# EAGLE design interstage_B2v2 (EAGLE 9.6.1)
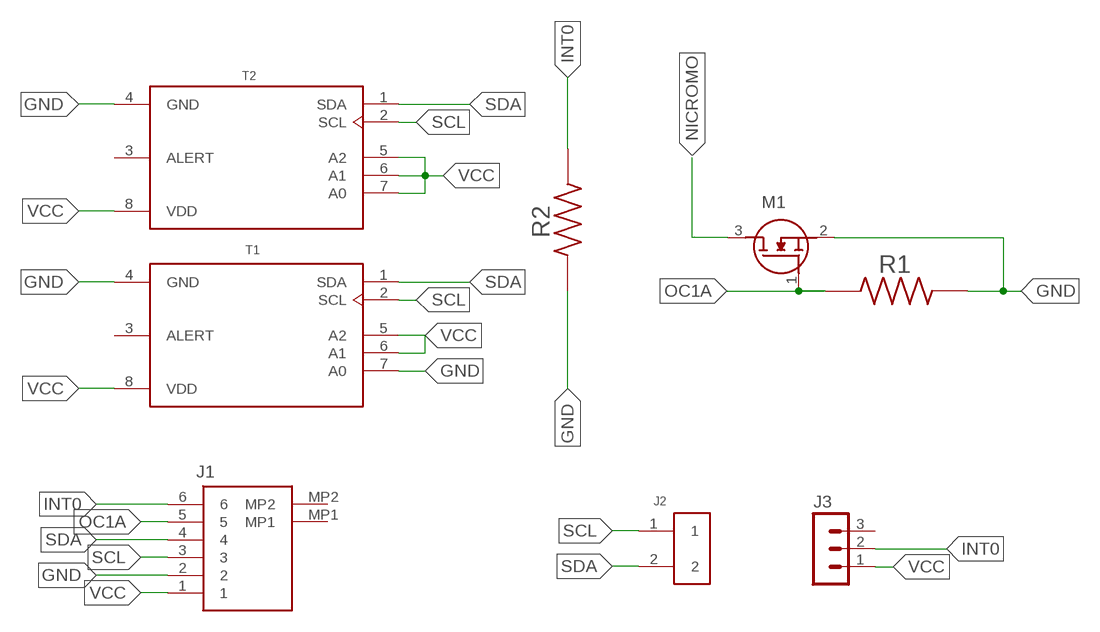
[diagram p0: schematic, sheet 1]

## Parts
J1  53261-7006  [532617006]
J2  0532610271  [MOLEX_0532610271]
J3  MA03-1  [MA03-1]
M1  PMV16XNR  [SOT95P230X110-3N]
R1  330  ERA-8AEB331V  [RESC3216X70N]
R2  330  ERA-8AEB331V  [RESC3216X70N]
T1  MCP9808T-E/MS  [SOP65P490X110-8N]
T2  MCP9808T-E/MS  [SOP65P490X110-8N]

## Nets
GND: J1.2 M1.2(S) R1.2 R2.1 T1.4(GND) T1.7(A0) T2.4(GND)
INT0: J1.6 J3.2 R2.2
NICROMO: M1.3(D)
OC1A: J1.5 M1.1(G) R1.1
SCL: J1.3 J2.1 T1.2(SCL) T2.2(SCL)
SDA: J1.4 J2.2 T1.1(SDA) T2.1(SDA)
VCC: J1.1 J3.1 T1.5(A2) T1.6(A1) T1.8(VDD) T2.5(A2) T2.6(A1) T2.7(A0) T2.8(VDD)
Unconnected: J1.MP1 J1.MP2 J3.3 T1.3(ALERT) T2.3(ALERT)

## Library data of the parts
J1 = SamacSys_Parts:53261-7006: 1.25mm Pitch, PicoBlade PCB Header, Single Row, Right-Angle, Surface Mount, Gold (Au) Plating, Friction Lock, Circuits, Tape and Reel Source: Datasheet <https://componentsearchengine.com/Datasheets/1/53261-7006.pdf>; DESCRIPTION: 1.25mm Pitch, PicoBlade PCB Header, Single Row, Right-Angle, Surface Mount, Gold (Au) Plating, Friction Lock, Circuits, Tape and Reel; HEIGHT: 3.6mm; MANUFACTURER_NAME: Molex; MANUFACTURER_PART_NUMBER: 53261-7006; MOUSER_PART_NUMBER: 538-53261-7006; MOUSER_PRICE-STOCK: https://www.mouser.co.uk/ProductDetail/Molex/53261-7006?qs=0lSvoLzn4L%2FSBef0BTU2GA%3D%3D
J2 = picoblade2:0532610271: 1.25mm (.049") Pitch PicoBlade Header, Surface Mount, Right Angle, Lead-free, 2 Circuits; AVAILABILITY: Unavailable; DESCRIPTION: Picoblade Connector, 2 Circuit Single Row, Right Angle Surface Mount SMT PCB; DIGIKEY-PURCHASE-URL: https://snapeda.com/shop?store=DigiKey&id=4477935; MF: Molex; MP: 0532610271; PACKAGE: None; PRICE: None
J3 = con-lstb:MA03-1: PIN HEADER; OC_FARNELL: unknown; OC_NEWARK: unknown
M1 = SamacSys_Parts:PMV16XNR: Nexperia PMV16XNR N-channel MOSFET, 8.6 A, 20 V PMV16XN, 3-Pin SOT-23 Source: Datasheet <https://componentsearchengine.com/Datasheets/1/PMV16XNR.pdf>; DESCRIPTION: Nexperia PMV16XNR N-channel MOSFET, 8.6 A, 20 V PMV16XN, 3-Pin SOT-23; HEIGHT: 1.1mm; MANUFACTURER_NAME: Nexperia; MANUFACTURER_PART_NUMBER: PMV16XNR; MOUSER_PART_NUMBER: 771-PMV16XNR; MOUSER_PRICE-STOCK: https://www.mouser.com/Search/Refine.aspx?Keyword=771-PMV16XNR
R1 R2 = resistor_330_smd:ERA-8AEB331V; DESCRIPTION: 330 Ohms ±0.1% 0.25W, 1/4W Chip Resistor 1206 (3216 Metric) Automotive AEC-Q200 Thin Film; DIGI-KEY_PART_NUMBER: P330BCCT-ND; MF: Panasonic Electronic; MP: ERA-8AEB331V; PACKAGE: 3216 Panasonic Electronic Components
T1 T2 = sensorSPEL:MCP9808T-E/MS: Board Mount Temperature Sensors Silicon temp sensor with I2C interface; DESCRIPTION: Temperature Sensor Digital, Local -40°C ~ 125°C 10 b 8-MSOP; DIGI-KEY_PART_NUMBER: MCP9808T-E/MSCT-ND; MF: Microchip; MP: MCP9808T-E/MS; PACKAGE: MSOP-8 Microchip

## Board
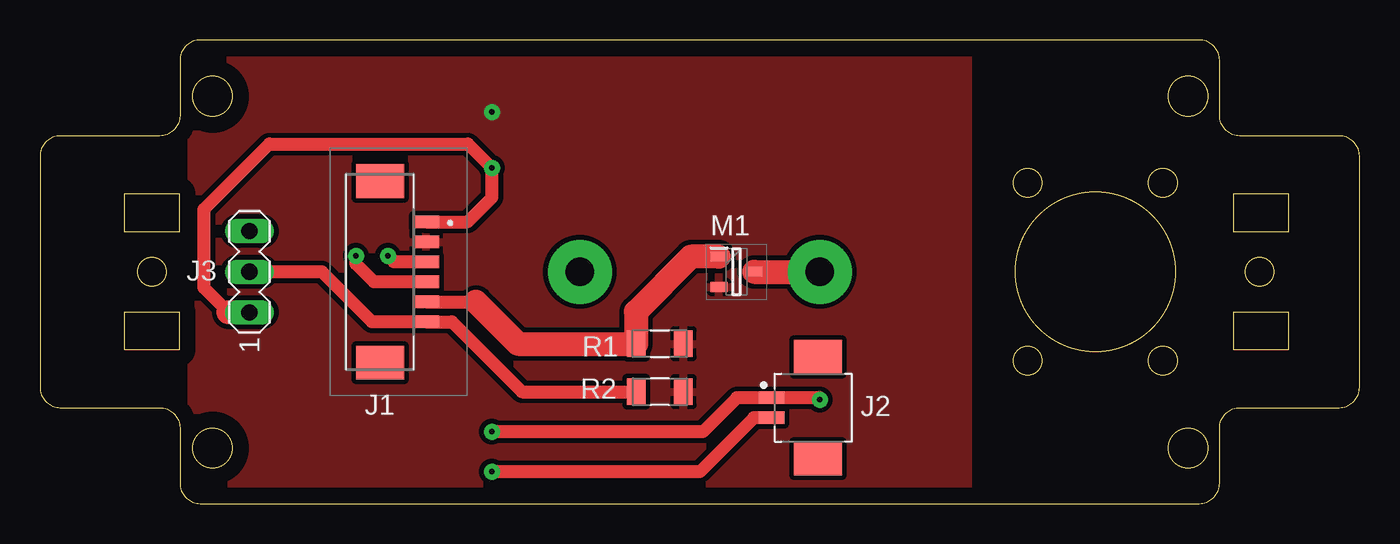
[diagram p1: board, top side]
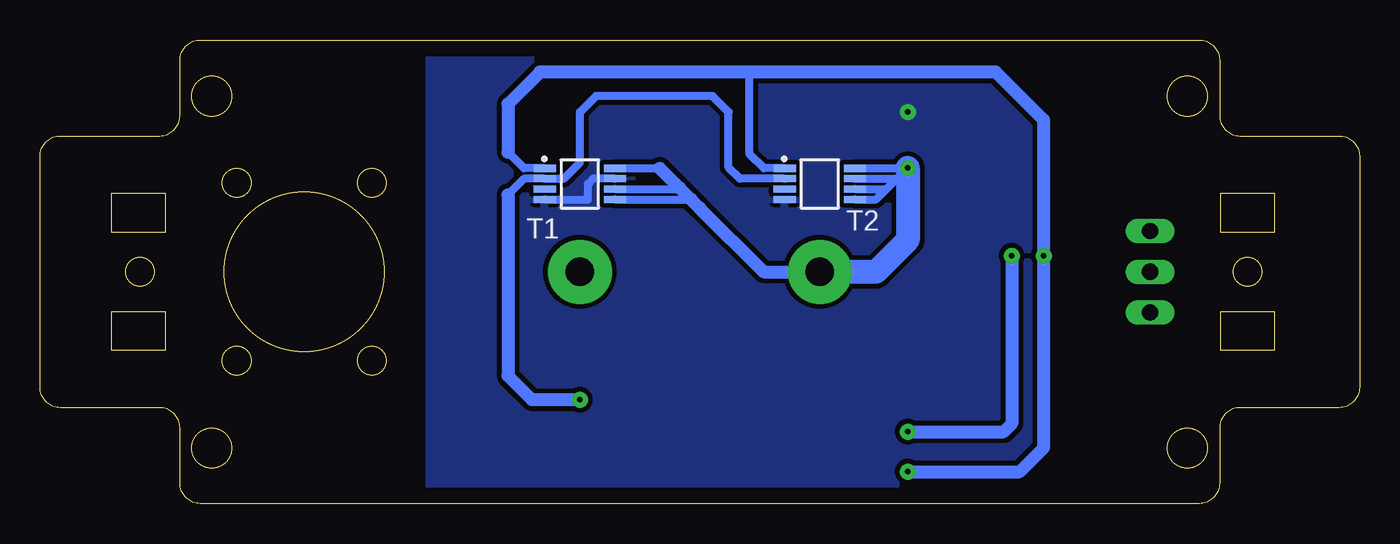
[diagram p2: board, bottom side, seen from below]

Size 82.5 x 29 mm. Coordinates in mm from the lower left corner, seen from the top.
Outline: 78.05,12 78.05,9.6 74.65,9.6 74.65,12 78.05,12
Outline: 78.05,19.4 78.05,17 74.65,17 74.65,19.4 78.05,19.4
Outline: 8.7,12 8.7,9.6 5.3,9.6 5.3,12 8.7,12
Outline: 8.7,19.4 8.7,17 5.3,17 5.3,19.4 8.7,19.4
Outline: 72.48,29 10.02,29 arc90 8.75,27.73 8.75,24.27 arc-90 7.48,23 1.27,23 arc90 0,21.73 0,7.27 arc90 1.27,6 7.48,6 arc-90 8.75,4.73 8.75,1.27 arc90 10.02,0 72.48,0 arc90 73.75,1.27 73.75,4.73 arc-90 75.02,6 81.23,6 arc90 82.5,7.27 82.5,21.73 arc90 81.23,23 75.02,23 arc-90 73.75,24.27 73.75,27.73 arc90 72.48,29
Outline: circle at 76.25,14.5 radius 0.9
Outline: circle at 61.75,20.06 radius 0.9
Outline: circle at 61.75,8.94 radius 0.9
Outline: circle at 70.2,8.94 radius 0.9
Outline: circle at 70.2,20.06 radius 0.9
Outline: circle at 65.97,14.5 radius 5
Outline: circle at 7,14.5 radius 0.9
Outline: circle at 71.78,25.48 radius 1.25
Outline: circle at 10.78,3.48 radius 1.25
Outline: circle at 10.78,25.48 radius 1.25
Outline: circle at 71.78,3.48 radius 1.25
Copper layers (1*16): Top 0.035mm / dielectric 1.5mm / Bottom 0.035mm
Design rules "default *": minimum track width 6mil, minimum drill 0.35mm, track to track 0.3mm, track to pad 6mil, pad to pad 6mil, via to via 6mil, smd to smd 6mil, copper to edge 40mil, drill to drill 6mil, minimum pad ring 10mil, minimum via ring 8mil, stop-mask expansion 4mil, vias tented up to drill 0mil, thermal gap 10mil

### Footprints (pad centres in the part's own frame; a part is rotated, then mirrored left to right if it is on the bottom)
532617006 = smd 0.8 x 1.6: 1 3.125,-2.5; 2 1.875,-2.5; 3 0.625,-2.5; 4 -0.625,-2.5; 5 -1.875,-2.5; 6 -3.125,-2.5 | smd 2.1 x 3: MP1 5.675,0.4; MP2 -5.675,0.4
MOLEX_0532610271 = smd 0.8 x 1.6: 1 0.625,0; 2 -0.625,0 | smd 2.1 x 3: 3 -3.175,-2.9; 4 3.175,-2.9
MA03-1 = drill 1.016 long: 1 -2.54,0; 2 0,0; 3 2.54,0
SOT95P230X110-3N = smd 1.05 x 0.6: 1 -1.1,0.95; 2 -1.1,-0.95; 3 1.1,0
RESC3216X70N = smd 1.16 x 1.68: 1 -1.475,0; 2 1.475,0
SOP65P490X110-8N = smd 1.4 x 0.45: 1 -2.2,0.975; 2 -2.2,0.325; 3 -2.2,-0.325; 4 -2.2,-0.975; 5 2.2,-0.975; 6 2.2,-0.325; 7 2.2,0.325; 8 2.2,0.975

### Placement (x,y rotation side)
J1  21.65,14.5 90 top
J2  45.75,6 90 top
J3  13.1,14.5 90 top
M1  43.55,14.5 0 top
R1  38.75,10 0 top
R2  38.75,7 180 top
T1  48.75,20 0 bottom
T2  33.75,20 0 bottom

### Tracks (layer width: path | path; a pad name or v marks a point on that pad's centre or on a via)
GND  (via drill 0.35 pad 1)
  Bottom 0.5: T1.7 47.92,20.32 48.25,20 48.25,19 48.27,19.02 T1.4
  other vias: 28.25,24.5
  pour Top: 9.45,28 9.45,0.6 58.05,0.6 58.05,28.1 57.95,28
  pour Bottom: 9.45,28 9.45,0.5 9.55,0.4 58.15,0.4 58.15,28
INT0
  Top 0.8: J3.2 17.62,14.5 20.75,11.38 J1.6 25.75,11.38 30.12,7 R2.2
NICROMO  (via drill 1.8 pad 4)
  Top 1.5: M1.3 v48.75,14.5
OC1A
  Top 0.5: R1.1 37.25,10.03
  Top 0.8: J1.5 27.25,12.62
  Top 1.5: 37.25,10.03 37.25,12 40.7,15.45 M1.1 | 27.25,12.62 29.88,10 R1.1
SCL  (via drill 0.35 pad 1)
  Top 0.8: v48.75,6.5 48.75,6.62 J2.1 43.58,6.62 41.45,4.5 v28.25,4.5 | J1.3 22.12,15.12 v21.75,15.5
  Bottom 0.5: T2.2 38.75,20.32 39.45,21.02 39.45,24.5 40.45,25.5 47.75,25.5 48.75,24.5 48.75,21.32 49.75,20.32 T1.2 52.25,20.32 53.25,19.32
  Bottom 0.8: 53.25,19.32 53.25,8 51.75,6.5 v48.75,6.5 | v21.75,15.5 21.75,5 22.25,4.5 v28.25,4.5
SDA  (via drill 0.35 pad 1)
  Top 0.8: J2.2 44.62,5.38 41.25,2 v28.25,2 | J1.4 20.88,13.88 19.75,15 v19.75,15.5
  Bottom 0.5: T2.1 37.25,20.98 38.15,21.88 38.15,27 | T1.1 52.25,20.98 53.25,21.98
  Bottom 0.8: v28.25,2 21.25,2 19.75,3.5 v19.75,15.5 19.75,24 22.75,27 38.15,27 51.25,27 53.25,25 53.25,21.98
VCC  (via drill 0.35 pad 1, 1.8 pad 4)
  Top 0.8: J1.1 26.73,17.62 28.25,19.15 v28.25,21 26.75,22.5 14.33,22.5 10.25,18.42 10.25,13.5 11.79,11.96
  Top 1.5: J3.1 11.79,11.96
  Bottom 0.5: T2.5 30.23,19.02 29.57,19.68 | T2.8 28.25,20.98 v28.25,21 28.93,20.32 | 28.93,20.32 29.57,19.68 | T2.7 28.93,20.32 | T2.6 29.57,19.68 | T1.6 42.58,19.68 | T1.8 43.76,20.98 | T1.5 41.79,19.02
  Bottom 0.6: 42.58,19.68 42.52,19.74 42.51,19.74
  Bottom 0.8: 42.52,19.74 42.78,20 43.76,20.98 | 42.51,19.74 41.79,19.02 41.26,18.49 | 41.26,18.49 37.25,14.5 v33.75,14.5 | 41.26,18.49
  Bottom 1.5: v28.25,21 28.25,16.5 30.25,14.5 v33.75,14.5